# EAGLE design bmscable (EAGLE 4.13)
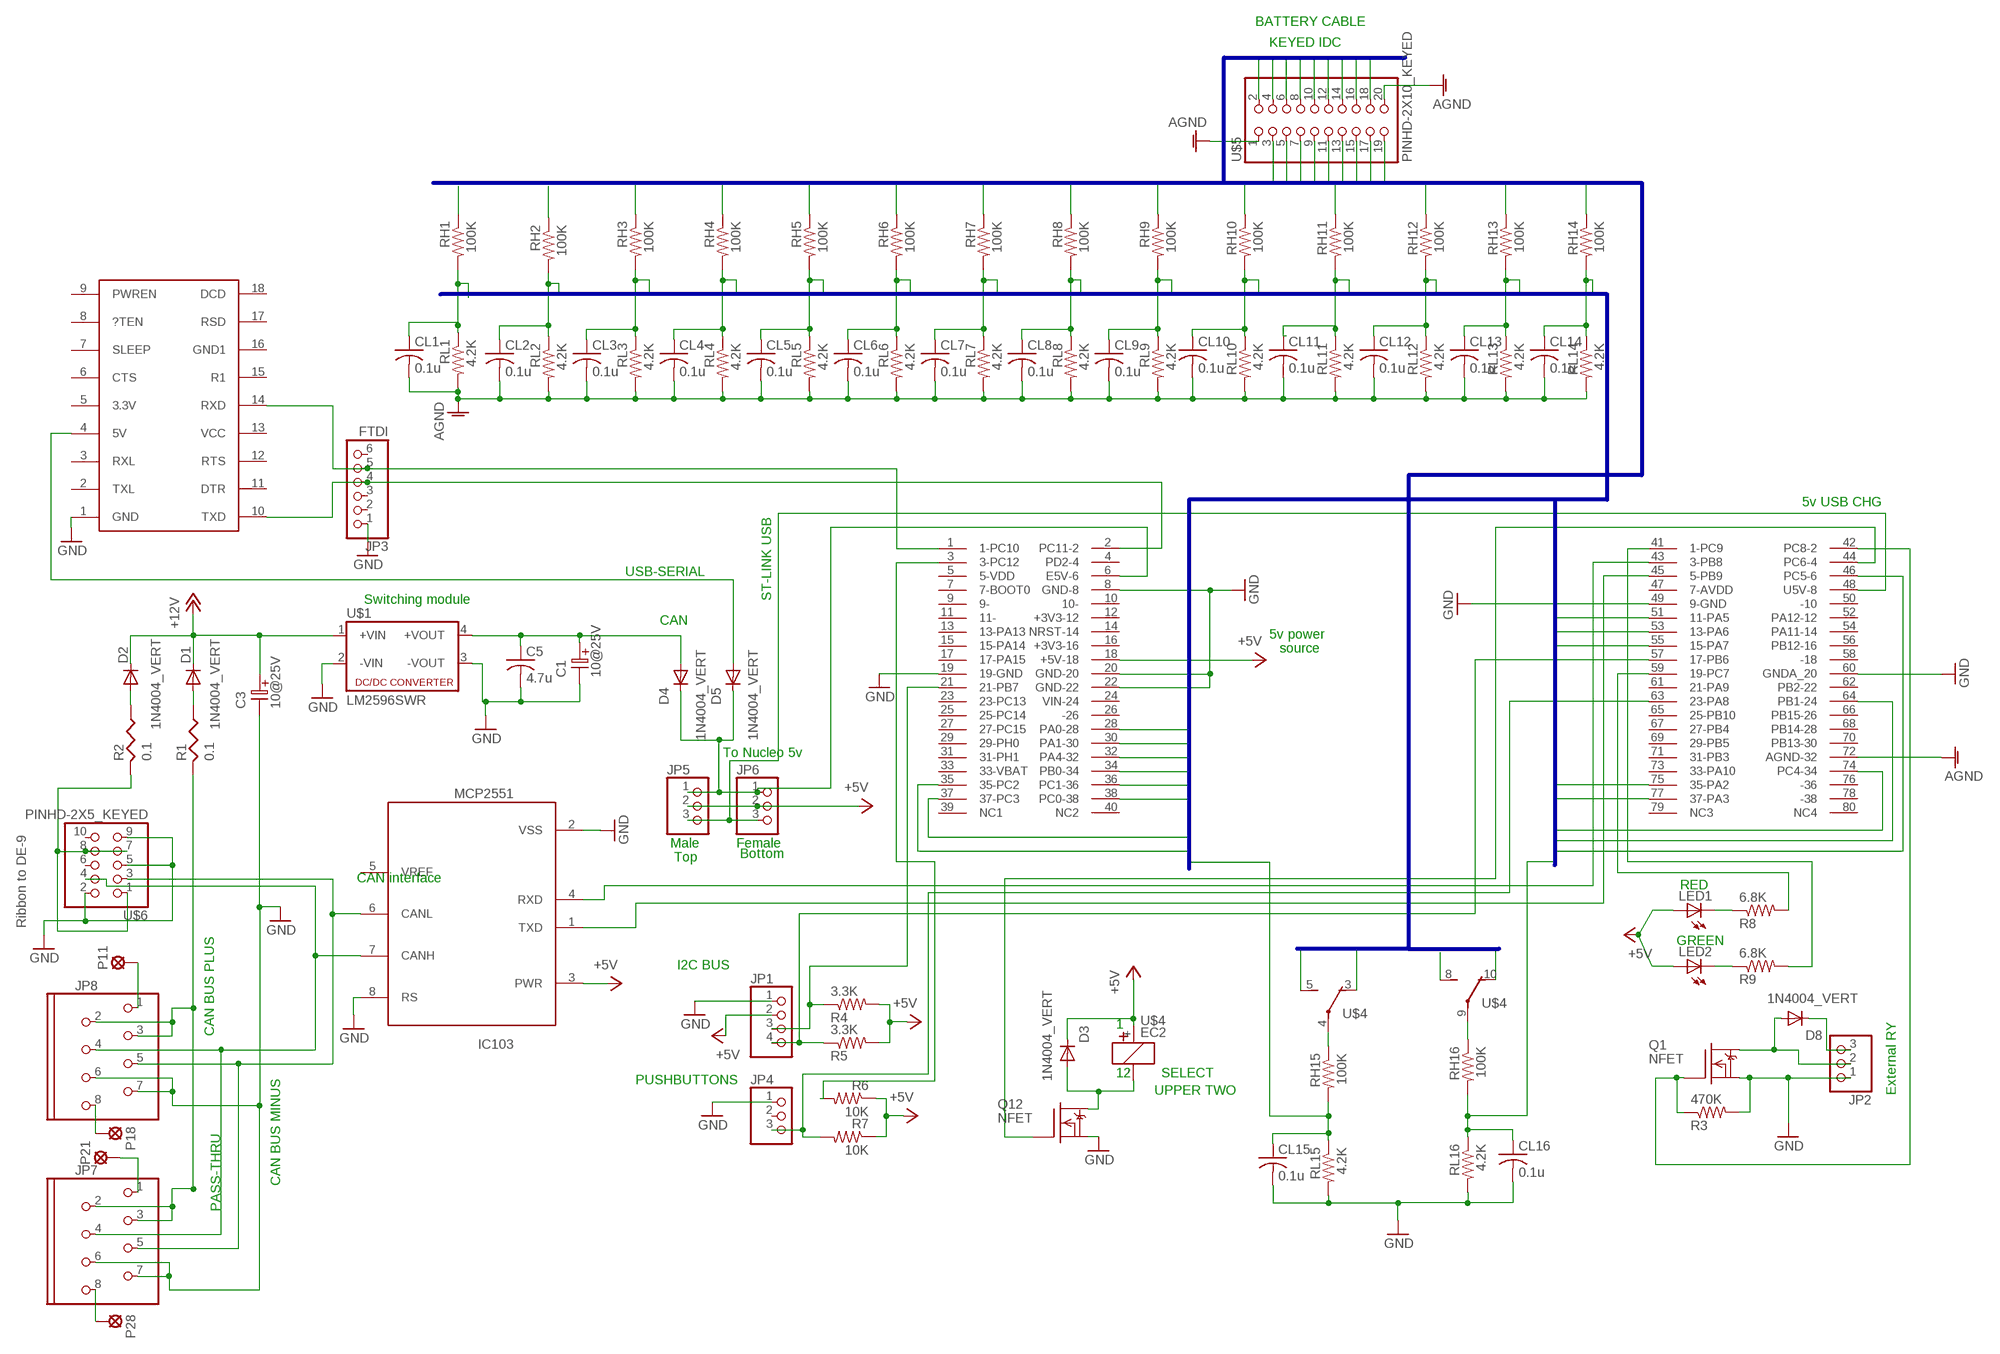
[diagram p0: schematic, sheet 1]

## Parts
C1  10@25V  ELC-2,5L  [ES-2,5L]
C3  10@25V  ELC-2,5L  [ES-2,5L]
C5  4.7u  C-USC0603  [C0603]
CL1  0.1u  C-USC0603  [C0603]
CL2  0.1u  C-USC0603  [C0603]
CL3  0.1u  C-USC0603  [C0603]
CL4  0.1u  C-USC0603  [C0603]
CL5  0.1u  C-USC0603  [C0603]
CL6  0.1u  C-USC0603  [C0603]
CL7  0.1u  C-USC0603  [C0603]
CL8  0.1u  C-USC0603  [C0603]
CL9  0.1u  C-USC0603  [C0603]
CL10  0.1u  C-USC0603  [C0603]
CL11  0.1u  C-USC0603  [C0603]
CL12  0.1u  C-USC0603  [C0603]
CL13  0.1u  C-USC0603  [C0603]
CL14  0.1u  C-USC0603  [C0603]
CL15  0.1u  C-USC0603  [C0603]
CL16  0.1u  C-USC0603  [C0603]
D1  1N4004_VERT  [DO41-10_VERT]
D2  1N4004_VERT  [DO41-10_VERT]
D3  1N4004_VERT  [DO41-10_VERT]
D4  1N4004_VERT  [DO41-10_VERT]
D5  1N4004_VERT  [DO41-10_VERT]
D8  1N4004_VERT  [DO41-10_VERT]
IC103  MCP2551  [SO-08]
JP1  PINHD-1X4  [1X04]
JP2  PINHD-1X3  [1X03]
JP3  FTDI  PINHD-1X6  [1X06]
JP4  PINHD-1X3  [1X03]
JP5  PINHD-1X3  [1X03]
JP6  PINHD-1X3  [1X03]
JP7  MOD8P8C  [MOD8P8C]
JP8  MOD8P8C  [MOD8P8C]
LED1  LEDCHIP-LED0603  [CHIP-LED0603]
LED2  LEDCHIP-LED0603  [CHIP-LED0603]
P11  SOLPAD035  [SOLDPAD035]
P18  SOLPAD035  [SOLDPAD035]
P21  SOLPAD035  [SOLDPAD035]
P28  SOLPAD035  [SOLDPAD035]
Q1  NFET  DMN3404L  [SOT-23]
Q12  NFET  DMN3404L  [SOT-23]
R1  0.1  RESUS-S2,5  [RS-2,5]
R2  0.1  RESUS-S2,5  [RS-2,5]
R3  470K  R-US_R0603  [R0603]
R4  3.3K  R-US_R0603  [R0603]
R5  3.3K  R-US_R0603  [R0603]
R6  10K  R-US_R0603  [R0603]
R7  10K  R-US_R0603  [R0603]
R8  6.8K  R-US_R0603  [R0603]
R9  6.8K  R-US_R0603  [R0603]
RH1  100K  R-US_R0603  [R0603]
RH2  100K  R-US_R0603  [R0603]
RH3  100K  R-US_R0603  [R0603]
RH4  100K  R-US_R0603  [R0603]
RH5  100K  R-US_R0603  [R0603]
RH6  100K  R-US_R0603  [R0603]
RH7  100K  R-US_R0603  [R0603]
RH8  100K  R-US_R0603  [R0603]
RH9  100K  R-US_R0603  [R0603]
RH10  100K  R-US_R0603  [R0603]
RH11  100K  R-US_R0603  [R0603]
RH12  100K  R-US_R0603  [R0603]
RH13  100K  R-US_R0603  [R0603]
RH14  100K  R-US_R0603  [R0603]
RH15  100K  R-US_R0603  [R0603]
RH16  100K  R-US_R0603  [R0603]
RL1  4.2K  R-US_R0603  [R0603]
RL2  4.2K  R-US_R0603  [R0603]
RL3  4.2K  R-US_R0603  [R0603]
RL4  4.2K  R-US_R0603  [R0603]
RL5  4.2K  R-US_R0603  [R0603]
RL6  4.2K  R-US_R0603  [R0603]
RL7  4.2K  R-US_R0603  [R0603]
RL8  4.2K  R-US_R0603  [R0603]
RL9  4.2K  R-US_R0603  [R0603]
RL10  4.2K  R-US_R0603  [R0603]
RL11  4.2K  R-US_R0603  [R0603]
RL12  4.2K  R-US_R0603  [R0603]
RL13  4.2K  R-US_R0603  [R0603]
RL14  4.2K  R-US_R0603  [R0603]
RL15  4.2K  R-US_R0603  [R0603]
RL16  4.2K  R-US_R0603  [R0603]
U$1  LM2596SWR  [LM2596SW]
U$2  NUCLEO446R-20  [NUCLEO-64-20]
U$3  USB-UART  [USB-UART]
U$4  EC2  [EC2]
U$5  PINHD-2X10_KEYED  [2X10_KEYED]
U$6  PINHD-2X5_KEYED  [2X05_KEYED]

## Nets
+5V: D3.C IC103.3(PWR) JP1.2 JP5.2 JP6.2 LED1.A LED2.A R4.2 R5.2 R6.1 R7.1 U$2.18(+5V-18) U$4.+
+12V: C3.1 D1.C D2.C U$1.1(+VIN)
ADC0: CL1.1 RH1.2 RL1.1 U$2.28(PA0-28)
ADC1: CL2.1 RH2.2 RL2.1 U$2.30(PA1-30)
ADC2: CL3.1 RH3.2 RL3.1 U$2.75(35-PA2)
ADC3: CL4.1 RH4.2 RL4.1 U$2.77(37-PA3)
ADC4: CL5.1 RH5.2 RL5.1 U$2.32(PA4-32)
ADC5: CL6.1 RH6.2 RL6.1 U$2.51(11-PA5)
ADC6: CL7.1 RH7.2 RL7.1 U$2.53(13-PA6)
ADC7: CL8.1 RH8.2 RL8.1 U$2.55(15-PA7)
ADC8: CL9.1 RH9.2 RL9.1 U$2.34(PB0-34)
ADC9: CL10.1 RH10.2 RL10.1 U$2.64(PB1-24)
ADC10: RH11.2 RL11.1 U$2.38(PC0-38)
ADC11: CL12.1 RH12.2 RL12.1 U$2.36(PC1-36)
ADC12: CL13.1 RH13.2 RL13.1 U$2.35(35-PC2)
ADC13: CL14.1 RH14.2 RL14.1 U$2.37(37-PC3)
ADC14: CL15.1 RH15.2 RL15.1 U$2.74(PC4-34)
ADC15: CL16.1 RH16.2 RL16.1 U$2.46(PC5-6)
AGND: CL1.2 CL2.2 CL3.2 CL4.2 CL5.2 CL6.2 CL7.2 CL8.2 CL9.2 CL10.2 CL11.2 CL12.2 CL13.2 CL14.2 RL1.2 RL2.2 RL3.2 RL4.2 RL5.2 RL6.2 RL7.2 RL8.2 RL9.2 RL10.2 RL11.2 RL12.2 RL13.2 RL14.2 U$2.72(AGND-32) U$5.1 U$5.20
C1: RH1.1 U$5.11
C2: RH2.1 U$5.2
C3: RH3.1 U$5.12
C4: RH4.1 U$5.3
C5: RH5.1 U$5.13
C6: RH6.1 U$5.4
C7: RH7.1 U$5.14
C8: RH8.1 U$5.5
C9: RH9.1 U$5.15
C10: RH10.1 U$5.6
C11: RH11.1 U$5.16
C12: RH12.1 U$5.7
C13: RH13.1 U$5.17
C14: RH14.1 U$5.8
C15: U$4.5(S) U$5.18
C16: U$4.8(S) U$5.9
C17: U$4.3(O) U$5.19
C18: U$4.10(O) U$5.10
CAN_RAW_PLUS: JP7.2 JP7.3 JP8.2 JP8.3 R1.2
CANCABLE_1_1: JP8.1 P11.MP
CANCABLE_1_8: JP8.8 P18.MP
CANCABLE_2_1: JP7.1 P21.MP
CANCABLE_2_8: JP7.8 P28.MP
D1-RESISTOR: D1.A R1.1
D2-RESISTOR: D2.A R2.1
E5V->NUCLEO: D4.C D5.C JP5.1 JP6.1 U$2.6(E5V-6)
FROM-DC-DC=CAN: C1.1 C5.1 D4.A U$1.4(+VOUT)
FROM-U5V: JP5.3 JP6.3 U$2.48(U5V-8)
FROM-USB-UART: D5.A U$3.4(5V)
GND: C1.2 C3.2 C5.2 CL15.2 CL16.2 IC103.2(VSS) IC103.8(RS) JP1.1 JP2.1 JP3.1 JP4.1 JP7.6 JP7.7 JP8.6 JP8.7 Q1.2(S) Q12.2(S) R3.2 RL15.2 RL16.2 U$1.2(-VIN) U$1.3(-VOUT) U$2.8(GND-8) U$2.19(19-GND) U$2.20(GND-20) U$2.22(GND-22) U$2.49(9-GND) U$2.60(GNDA_20) U$3.1(GND) U$6.2 U$6.5 U$6.9
MCP2551_CANH: IC103.7(CANH) JP7.4 JP8.4 U$6.4
MCP2551_CANL: IC103.6(CANL) JP7.5 JP8.5 U$6.3
N$3: R2.2 U$6.1 U$6.7 U$6.8
N$4: D8.A JP2.2 Q1.3(D)
N$5: D8.C JP2.3
N$6: JP4.3 R7.2 U$2.63(23-PA8)
N$7: LED2.C R9.1
N$8: RH16.1 U$4.9(P)
N$9: RH15.1 U$4.4(P)
N$10: LED1.C R8.1
PB6-I2C1-SCL: JP1.4 R5.1 U$2.57(17-PB6)
PB7-I2C1-SCL: JP1.3 R4.1 U$2.21(21-PB7)
PB8-CAN-RX: IC103.4(RXD) U$2.43(3-PB8)
PB9-CAN-TX: IC103.1(TXD) U$2.45(5-PB9)
PC6-Q12-GATE: Q12.1(G) U$2.44(PC6-4)
PC7-LED-GREEN: R8.2 U$2.59(19-PC7)
PC8-FETGATE-CHGR-RELAY: Q1.1(G) R3.1 U$2.42(PC8-2)
PC9-LED-RED: R9.2 U$2.41(1-PC9)
PC12-SWITCH: R6.2 U$2.3(3-PC12)
Q12-DRAIN-RELAY: D3.A Q12.3(D) U$4.-
USART3-RX: JP3.4 U$2.2(PC11-2) U$3.10(TXD)
USART3-TX: JP3.5 U$2.1(1-PC10) U$3.14(RXD)
Unconnected: CL11.1 IC103.5(VREF) JP3.2 JP3.3 JP3.6 JP4.2 U$2.4(PD2-4) U$2.5(5-VDD) U$2.7(7-BOOT0) U$2.9(9-) U$2.10(10-) U$2.11(11-) U$2.12(+3V3-12) U$2.13(13-PA13) U$2.14(NRST-14) U$2.15(15-PA14) U$2.16(+3V3-16) U$2.17(17-PA15) U$2.23(23-PC13) U$2.24(VIN-24) U$2.25(25-PC14) U$2.26(-26) U$2.27(27-PC15) U$2.29(29-PH0) U$2.31(31-PH1) U$2.33(33-VBAT) U$2.39(NC1) U$2.40(NC2) U$2.47(7-AVDD) U$2.50(-10) U$2.52(PA12-12) U$2.54(PA11-14) U$2.56(PB12-16) U$2.58(-18) U$2.61(21-PA9) U$2.62(PB2-22) U$2.65(25-PB10) U$2.66(PB15-26) U$2.67(27-PB4) U$2.68(PB14-28) U$2.69(29-PB5) U$2.70(PB13-30) U$2.71(31-PB3) U$2.73(33-PA10) U$2.76(-36) U$2.78(-38) U$2.79(NC3) U$2.80(NC4) U$3.2(TXL) U$3.3(RXL) U$3.5(3.3V) U$3.6(CTS) U$3.7(SLEEP) U$3.8(?TEN) U$3.9(PWREN) U$3.11(DTR) U$3.12(RTS) U$3.13(VCC) U$3.15(R1) U$3.16(GND1) U$3.17(RSD) U$3.18(DCD) U$6.6 U$6.10

## Buses
C$1:C[0..18]
ADC$:ADC[0..15]

## Notes on the sheet
- BATTERY CABLE
- KEYED IDC
- 5v USB CHG
- USB-SERIAL
- Switching module | ST-LINK USB
- CAN
- 5v power
- source
- To Nucleo 5v
- Male | Female
- Top | Bottom
- CAN interface
- RED
- Ribbon to DE-9
- GREEN
- I2C BUS
- 1
- CAN BUS PLUS
- 12 | SELECT
- PUSHBUTTONS
- UPPER TWO | External RY
- PASS-THRU
- CAN BUS MINUS

## Library data of the parts
C1 C3 = DEH:ELC-2,5L
C5 CL1-CL16 = rcl:C-US: CAPACITOR, American symbol
D1-D5 D8 = diode:1N4004_VERT
IC103 = texas:MCP2551
JP1 = pinhead:PINHD-1X4: PIN HEADER
JP2 JP4-JP6 = pinhead:PINHD-1X3: PIN HEADER
JP3 = pinhead:PINHD-1X6: PIN HEADER
JP7 JP8 = DEH:MOD8P8C
LED1 LED2 = led:LED: LED OSRAM: - CHIPLED LG R971, LG N971, LY N971, LG Q971, LY Q971, LO R971, LY R971 LH N974, LH R974 LS Q976, LO Q976, LY Q976 LO Q996 - Hyper CHIPLED LW Q18S LB Q993, LB Q99A, LB R99A - SideLED LS A670, LO A670, LY A670, LG A670, LP A670 LB A673, LV A673, LT A673, LW A673 LH A674 LY A675 LS A676, LA A676, LO A676, LY A676, LW A676 LS A679, LY A679, LG A679 - Hyper Micro SIDELED® LS Y876, LA Y876, LO Y876, LY Y876 LT Y87S - SmartLED LW L88C, LW L88S LB L89C, LB L89S, LG L890 LS L89K, LO L89K, LY L89K LS L896, LA L896, LO L896, LY L896 - TOPLED LS T670, LO T670, LY T670, LG T670, LP T670 LSG T670, LSP T670, LSY T670, LOP T670, LYG T670 LG T671, LOG T671, LSG T671 LB T673, LV T673, LT T673, LW T673 LH T674 LS T676, LA T676, LO T676, LY T676, LB T676, LH T676, LSB T676, LW T676 LB T67C, LV T67C, LT T67C, LS T67K, LO T67K, LY T67K, LW E67C LS E67B, LA E67B, LO E67B, LY E67B, LB E67C, LV E67C, LT E67C LW T67C LS T679, LY T679, LG T679 LS T770, LO T770, LY T770, LG T770, LP T770 LB T773, LV T773, LT T773, LW T773 LH T774 LS E675, LA E675, LY E675, LS T675 LS T776, LA T776, LO T776, LY T776, LB T776 LHGB T686 LT T68C, LB T68C - Hyper Mini TOPLED® LB M676 - Mini TOPLED Santana® LG M470 LS M47K, LO M47K, LY M47K Source: http://www.osram.convergy.de/
P11 P18 P21 P28 = solpad:SOLPAD035
Q1 Q12 = transistor-fet:DMN3404L
R1 R2 = DEH:RESUS-S2,5
R3-R9 RH1-RH16 RL1-RL16 = rcl:R-US_: RESISTOR, American symbol
U$1 = dc-dc-converter:LM2596SWR
U$2 = pinhead:NUCLEO446R-20
U$3 = pinhead:USB-UART
U$4 = relay:EC2
U$5 = pinhead:PINHD-2X10_KEYED
U$6 = pinhead:PINHD-2X5_KEYED

## Board
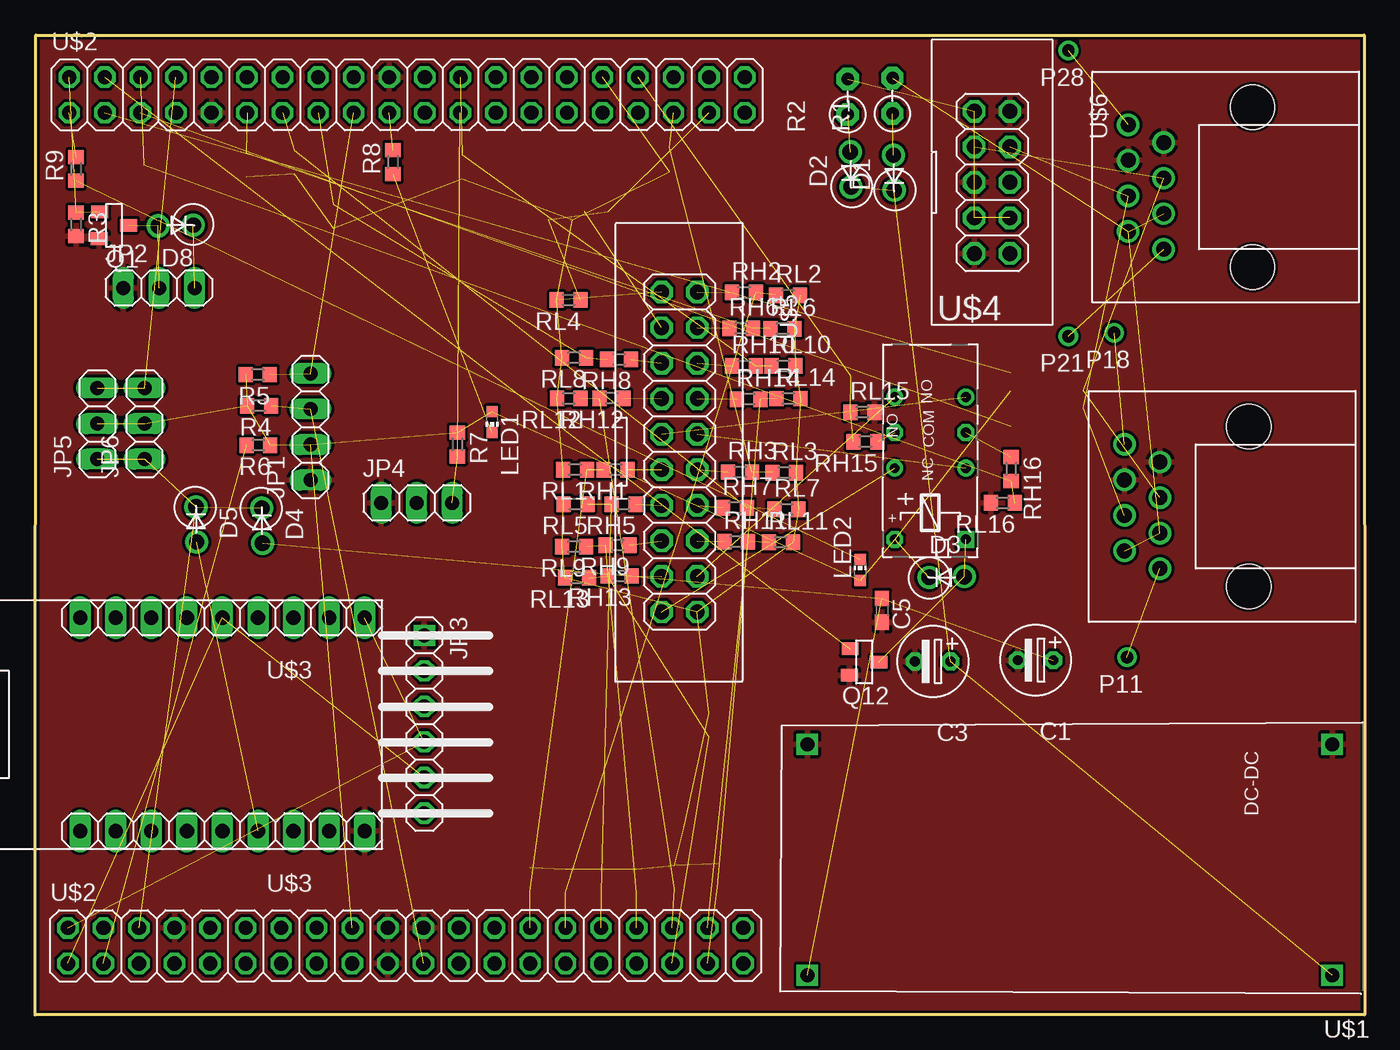
[diagram p1: board, top side]
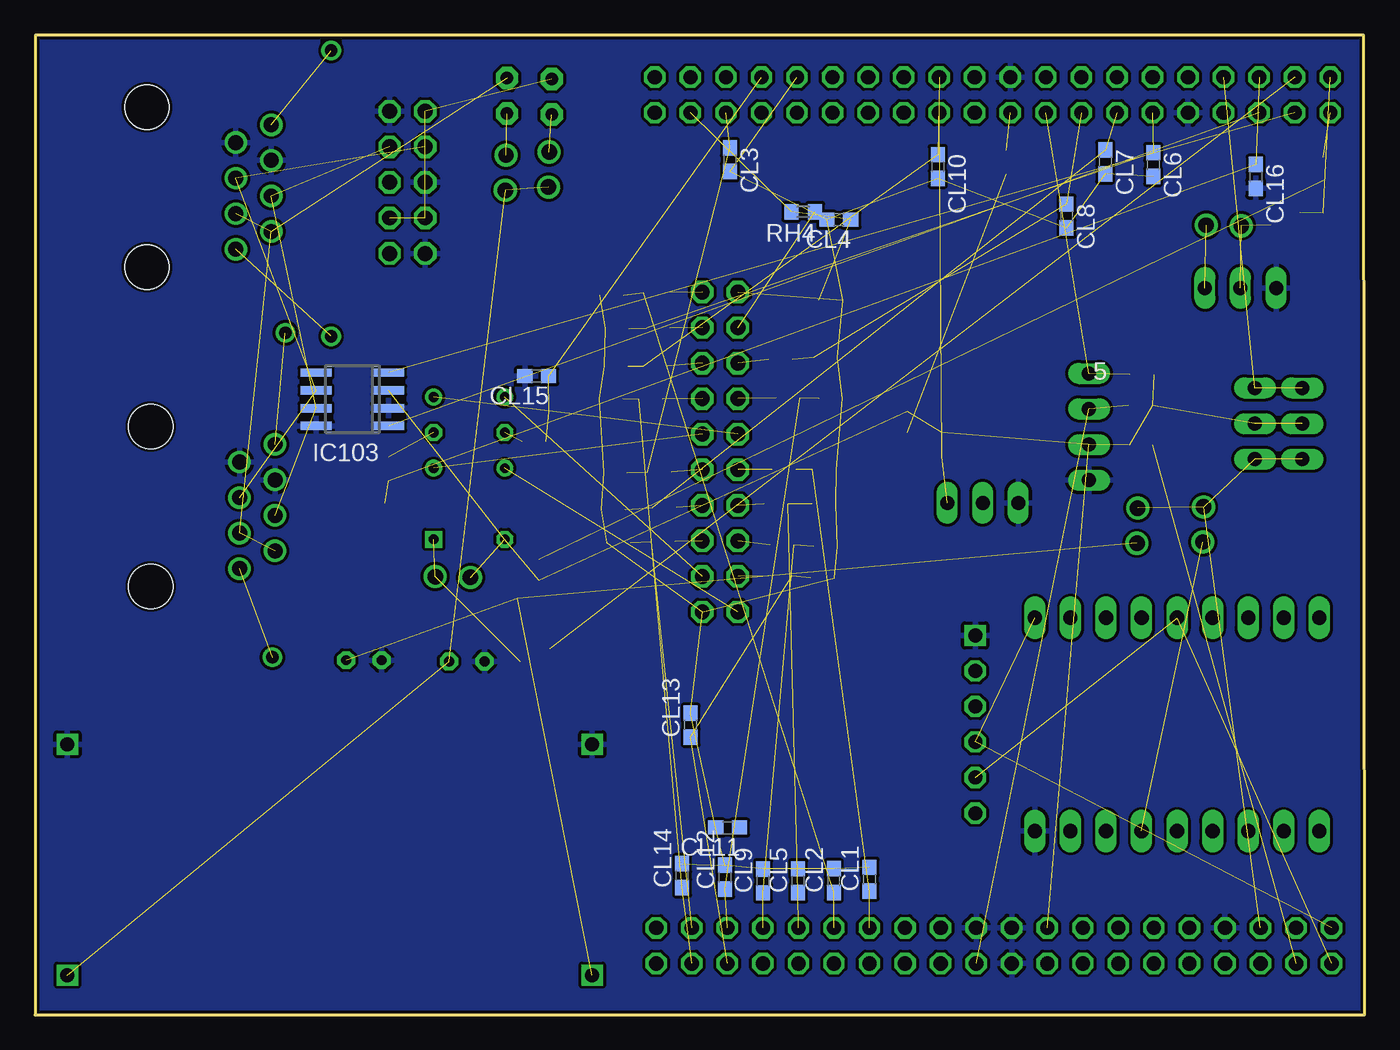
[diagram p2: board, bottom side, seen from below]

Size 95 x 70.03 mm. Coordinates in mm from the lower left corner, seen from the top.
Outline: 0,0 0.07,70.02 94.98,70.03 95,0 0,0
Copper layers (1*16): Top 0.035mm / dielectric 1.5mm / Bottom 0.035mm
Design rules "default": minimum track width 8mil, minimum drill 0.6mm, track to track 0.2083mm, track to pad 8mil, pad to pad 8mil, via to via 8mil, smd to smd 0mil, copper to edge 8mil, drill to drill 8mil, minimum pad ring 10mil, minimum via ring 8mil, stop-mask expansion 4mil, vias tented up to drill 0mil, thermal gap 10mil

### Footprints (pad centres in the part's own frame; a part is rotated, then mirrored left to right if it is on the bottom)
ES-2,5L = drill 0.711 pad 1.27 octagon: 1 0,0; 2 2.54,0
C0603 = smd 1.1 x 1: 1 -0.85,0; 2 0.85,0
DO41-10_VERT = drill 1.1 round: A 2.58,0.05; C 0.07,0
SO-08 = smd 0.6 x 2.2: 1 -1.905,-2.6; 2 -0.635,-2.6; 3 0.635,-2.6; 4 1.905,-2.6; 5 1.905,2.6; 6 0.635,2.6; 7 -0.635,2.6; 8 -1.905,2.6
1X04 = drill 1 long: 1 -3.81,0; 2 -1.27,0; 3 1.27,0; 4 3.81,0
1X03 = drill 1 long: 1 -2.54,0; 2 0,0; 3 2.54,0
1X06 = drill 1 square: 1 -6.35,0 | drill 1 octagon: 2 -3.81,0; 3 -1.27,0; 4 1.27,0; 5 3.81,0; 6 6.35,0
MOD8P8C = drill 1.067 pad 1.397 round: 1 -3.81,-2.54; 2 -2.54,0; 3 -1.27,-2.54; 4 0,0; 5 1.27,-2.54; 6 2.54,0; 7 3.81,-2.54; 8 5.08,0 | hole 3.175: -5.08,-8.89; 6.35,-8.89
CHIP-LED0603 = smd 0.8 x 0.8: A 0,-0.75; C 0,0.75
SOLDPAD035 = drill 0.889 pad 1.27 round: MP 0,0
SOT-23 = smd 0.9 x 1.2: 1 -1,-1.006; 2 0.9,-1.056; 3 -0.05,1.056
RS-2,5 = drill 0.889 pad 1.6 octagon: 1 0,0; 2 2.54,0
R0603 = smd 1 x 1.1: 1 -0.85,0; 2 0.85,0
LM2596SW = drill 1 square: 1 0,16.5; 2 0,0; 3 37.5,0; 4 37.5,16.5
NUCLEO-64-20 = drill 1.016 octagon: 1 -31.68,24.23; 2 -29.14,24.23; 3 -31.68,21.69; 4 -29.14,21.69; 5 -31.68,19.15; 6 -29.14,19.15; 7 -31.68,16.61; 8 -29.14,16.61; 9 -31.68,14.07; 10 -29.14,14.07; 11 -31.68,11.53; 12 -29.14,11.53; 13 -31.68,8.99; 14 -29.14,8.99; 15 -31.68,6.45; 16 -29.14,6.45; 17 -31.68,3.91; 18 -29.14,3.91; 19 -31.68,1.37; 20 -29.14,1.37; 21 -31.68,-1.17; 22 -29.14,-1.17; 23 -31.68,-3.71; 24 -29.14,-3.71; 25 -31.68,-6.25; 26 -29.14,-6.25; 27 -31.68,-8.79; 28 -29.14,-8.79; 29 -31.68,-11.33; 30 -29.14,-11.33; 31 -31.68,-13.87; 32 -29.14,-13.87; 33 -31.68,-16.41; 34 -29.14,-16.41; 35 -31.68,-18.95; 36 -29.14,-18.95; 37 -31.68,-21.49; 38 -29.14,-21.49; 39 -31.68,-24.03; 40 -29.14,-24.03; 41 29.12,24.13; 42 31.66,24.13; 43 29.12,21.59; 44 31.66,21.59; 45 29.12,19.05; 46 31.66,19.05; 47 29.12,16.51; 48 31.66,16.51; 49 29.12,13.97; 50 31.66,13.97; 51 29.12,11.43; 52 31.66,11.43; 53 29.12,8.89; 54 31.66,8.89; 55 29.12,6.35; 56 31.66,6.35; 57 29.12,3.81; 58 31.66,3.81; 59 29.12,1.27; 60 31.66,1.27; 61 29.12,-1.27; 62 31.66,-1.27; 63 29.12,-3.81; 64 31.66,-3.81; 65 29.12,-6.35; 66 31.66,-6.35; 67 29.12,-8.89; 68 31.66,-8.89; 69 29.12,-11.43; 70 31.66,-11.43; 71 29.12,-13.97; 72 31.66,-13.97; 73 29.12,-16.51; 74 31.66,-16.51; 75 29.12,-19.05; 76 31.66,-19.05; 77 29.12,-21.59; 78 31.66,-21.59; 79 29.12,-24.13; 80 31.66,-24.13
USB-UART = drill 1.016 long: 1 -7.62,-8.89; 2 -7.62,-6.35; 3 -7.62,-3.81; 4 -7.62,-1.27; 5 -7.62,1.27; 6 -7.62,3.81; 7 -7.62,6.35; 8 -7.62,8.89; 9 -7.62,11.43; 10 7.62,-8.89; 11 7.62,-6.35; 12 7.62,-3.81; 13 7.62,-1.27; 14 7.62,1.27; 15 7.62,3.81; 16 7.62,6.35; 17 7.62,8.89; 18 7.62,11.43
EC2 = drill 0.7 round: 3 -1.27,2.54; 5 3.81,2.54; 8 3.81,-2.54; 10 -1.27,-2.54 | drill 0.7 octagon: 4 1.27,2.54; 9 1.27,-2.54; + -6.35,2.54 | drill 0.7 square: - -6.35,-2.54
2X10_KEYED = drill 1.067 octagon: 1 -11.46,-1.27; 2 -11.46,1.27; 3 -8.92,-1.27; 4 -8.92,1.27; 5 -6.38,-1.27; 6 -6.38,1.27; 7 -3.84,-1.27; 8 -3.84,1.27; 9 -1.3,-1.27; 10 -1.3,1.27; 11 1.24,-1.27; 12 1.24,1.27; 13 3.78,-1.27; 14 3.78,1.27; 15 6.32,-1.27; 16 6.32,1.27; 17 8.86,-1.27; 18 8.86,1.27; 19 11.4,-1.27; 20 11.4,1.27
2X05_KEYED = drill 1.067 octagon: 1 -5.08,-1.27; 2 -5.08,1.27; 3 -2.54,-1.27; 4 -2.54,1.27; 5 0,-1.27; 6 0,1.27; 7 2.54,-1.27; 8 2.54,1.27; 9 5.08,-1.27; 10 5.08,1.27

### Placement (x,y rotation side)
C1  72.77,25.35 180 top
C3  65.42,25.26 180 top
C5  60.53,28.91 270 top
CL1  35.36,9.7 90 bottom
CL2  37.92,9.6 90 bottom
CL3  45.34,61.12 270 bottom
CL4  37.56,56.83 180 bottom
CL5  40.47,9.59 90 bottom
CL6  15.09,60.77 270 bottom
CL7  18.52,60.96 270 bottom
CL8  21.29,57.09 270 bottom
CL9  42.97,9.58 90 bottom
CL10  30.5,60.63 270 bottom
CL11  45.51,13.39 180 bottom
CL12  45.68,9.85 90 bottom
CL13  48.15,20.71 90 bottom
CL14  48.75,9.96 90 bottom
CL15  59.15,45.65 180 bottom
CL16  7.78,59.92 270 bottom
D1  61.39,58.86 90 top
D2  58.31,59.09 90 top
D3  63.82,31.27 0 top
D4  16.21,36.29 270 top
D5  11.5,36.38 270 top
D8  11.38,56.44 180 top
IC103  72.32,44 90 bottom
JP1  19.68,42.03 90 top
JP2  8.86,51.95 0 top
JP3  27.82,20.77 270 top
JP4  27.28,36.6 0 top
JP5  4.45,42.26 90 top
JP6  7.83,42.26 90 top
JP7  78.11,58.53 90 top
JP8  77.85,35.7 90 top
LED1  32.66,42.36 180 top
LED2  58.97,31.8 0 top
P11  78.03,25.55 180 top
P18  77.11,48.74 180 top
P21  73.84,48.5 180 top
P28  73.84,68.91 180 top
Q1  5.64,56.38 270 top
Q12  59.25,25.17 270 top
R1  61.27,64.41 90 top
R2  58.08,64.34 90 top
R3  2.93,56.5 270 top
R4  16.02,43.54 180 top
R5  15.92,45.76 180 top
R6  15.96,40.72 180 top
R7  30.19,40.77 270 top
R8  25.58,60.95 90 top
R9  2.93,60.46 90 top
RH1  41.49,38.96 180 top
RH2  50.66,51.63 0 top
RH3  50.38,38.8 0 top
RH4  40.1,57.4 180 bottom
RH5  42.06,36.5 180 top
RH6  50.47,49.07 0 top
RH7  50.01,36.25 0 top
RH8  41.74,46.85 180 top
RH9  41.63,33.57 180 top
RH10  50.67,46.38 0 top
RH11  50.1,33.82 0 top
RH12  41.2,44.07 180 top
RH13  41.76,31.37 180 top
RH14  51,44 0 top
RH15  59.34,40.96 180 top
RH16  69.75,39.02 270 top
RL1  38.59,38.97 180 top
RL2  53.81,51.43 0 top
RL3  53.53,38.75 0 top
RL4  38.13,51.09 180 top
RL5  38.62,36.5 180 top
RL6  53.42,49.04 0 top
RL7  53.7,36.13 0 top
RL8  38.51,46.97 180 top
RL9  38.52,33.46 180 top
RL10  53.48,46.38 0 top
RL11  53.3,33.78 0 top
RL12  38.14,44.06 180 top
RL13  38.74,31.24 180 top
RL14  53.83,44.05 0 top
RL15  59.12,43.07 0 top
RL16  69.15,36.6 180 top
U$1  92.68,19.34 180 top
U$2  26.58,35.36 90 top
U$3  14.66,20.76 90 top
U$4  63.97,40.34 90 top
U$5  46.05,40.2 270 top
U$6  68.39,59.5 270 top

### Tracks (layer width: path | path; a pad name or v marks a point on that pad's centre or on a via)
+5V  (12 unrouted)
+12V  (3 unrouted)
ADC0  (3 unrouted)
ADC1  (3 unrouted)
ADC2  (3 unrouted)
ADC3  (3 unrouted)
ADC4  (3 unrouted)
ADC5  (3 unrouted)
ADC6  (3 unrouted)
ADC7  (3 unrouted)
ADC8  (3 unrouted)
ADC9  (3 unrouted)
ADC10  (2 unrouted)
ADC11  (3 unrouted)
ADC12  (3 unrouted)
ADC13  (3 unrouted)
ADC14  (3 unrouted)
ADC15  (3 unrouted)
AGND  (30 unrouted)
C1  (1 unrouted)
C2  (1 unrouted)
C3  (1 unrouted)
C4  (1 unrouted)
C5  (1 unrouted)
C6  (1 unrouted)
C7  (1 unrouted)
C8  (1 unrouted)
C9  (1 unrouted)
C10  (1 unrouted)
C11  (1 unrouted)
C12  (1 unrouted)
C13  (1 unrouted)
C14  (1 unrouted)
C15  (1 unrouted)
C16  (1 unrouted)
C17  (1 unrouted)
C18  (1 unrouted)
CAN_RAW_PLUS  (4 unrouted)
CANCABLE_1_1  (1 unrouted)
CANCABLE_1_8  (1 unrouted)
CANCABLE_2_1  (1 unrouted)
CANCABLE_2_8  (1 unrouted)
D1-RESISTOR  (1 unrouted)
D2-RESISTOR  (1 unrouted)
E5V->NUCLEO  (4 unrouted)
FROM-DC-DC=CAN  (3 unrouted)
FROM-U5V  (2 unrouted)
FROM-USB-UART  (1 unrouted)
GND
  pour Bottom: -2.92,72.26 -2.92,-3.4 99.67,-3.4 99.67,72.02 -0.97,72.24 -0.98,72.24 -0.98,72.25
  pour Top: 0.01,71.26 -1.45,71.26 -1.45,-2.91 99.27,-2.91 99.27,0.75 99.27,71.66 1.47,71.66
MCP2551_CANH  (3 unrouted)
MCP2551_CANL  (3 unrouted)
N$3  (3 unrouted)
N$4  (2 unrouted)
N$5  (1 unrouted)
N$6  (2 unrouted)
N$7  (1 unrouted)
N$8  (1 unrouted)
N$9  (1 unrouted)
N$10  (1 unrouted)
PB6-I2C1-SCL  (2 unrouted)
PB7-I2C1-SCL  (2 unrouted)
PB8-CAN-RX  (1 unrouted)
PB9-CAN-TX  (1 unrouted)
PC6-Q12-GATE  (1 unrouted)
PC7-LED-GREEN  (1 unrouted)
PC8-FETGATE-CHGR-RELAY  (2 unrouted)
PC9-LED-RED  (1 unrouted)
PC12-SWITCH  (1 unrouted)
Q12-DRAIN-RELAY  (2 unrouted)
USART3-RX  (2 unrouted)
USART3-TX  (2 unrouted)

### Text on the board
bNames: 5
tValues: 3.3V | DIGITAL | +5V | 3.2v | ANALOG | 3.2